# Altium schematic sheet mikrokontroler.SchDoc: Control unit
size A4
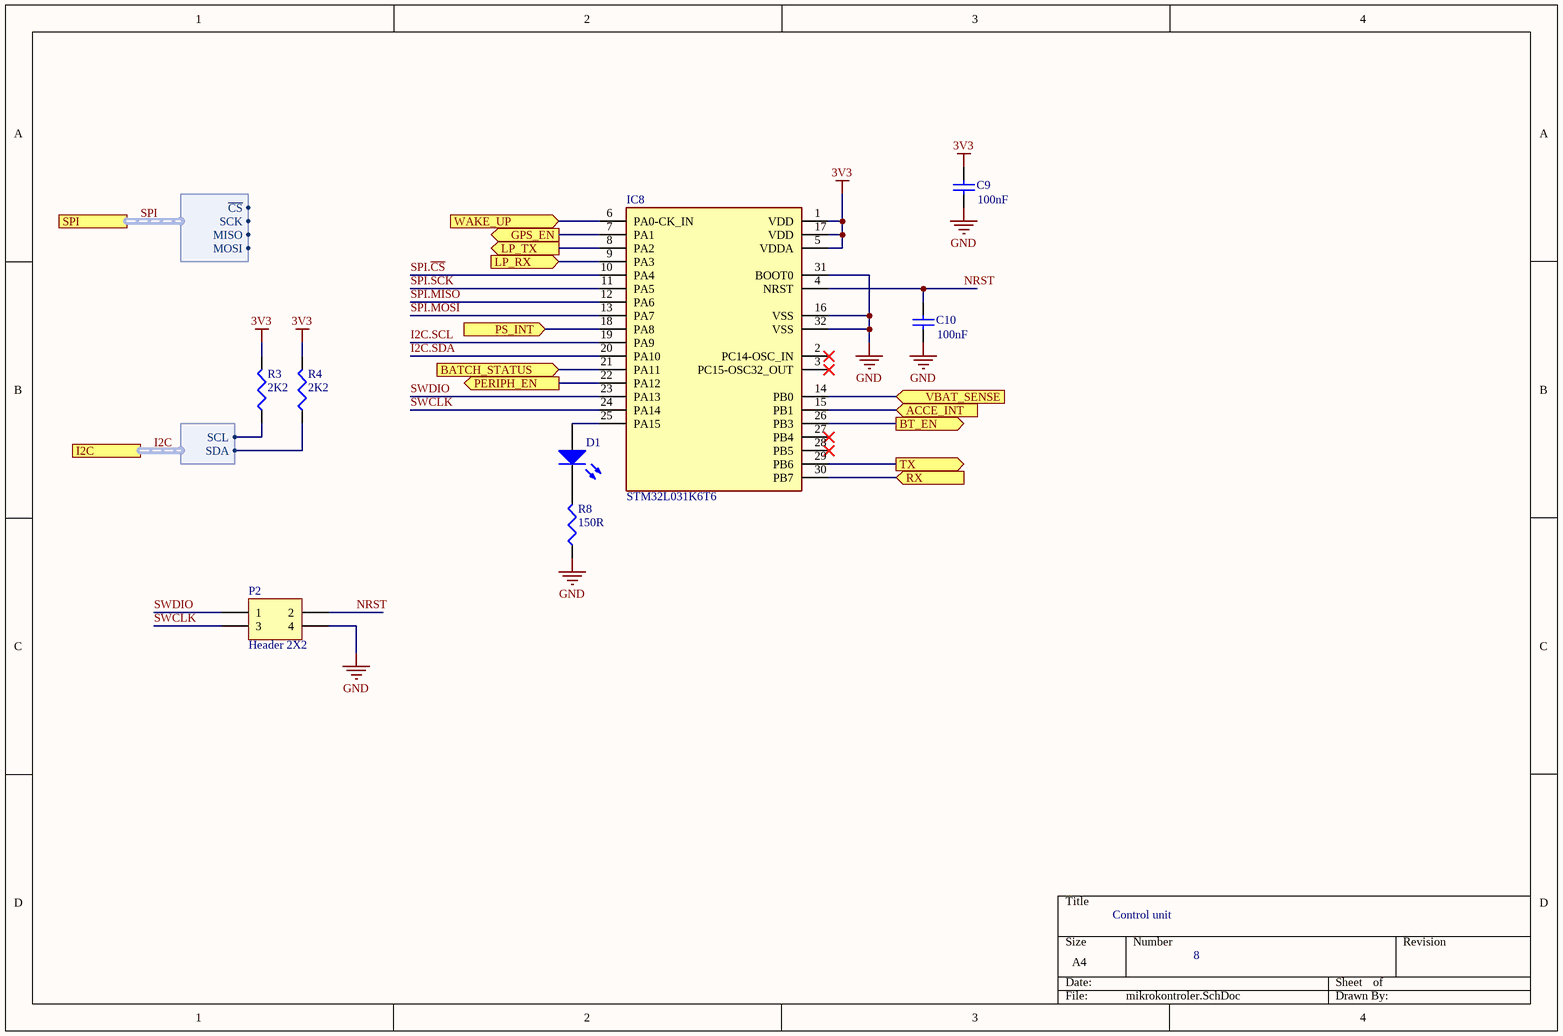
[diagram p0: mikrokontroler.SchDoc]

## Parts
C9  value 100nF  [C0805]  (hidden comment: Cap)
C10  value 100nF  [C0805]  (hidden comment: Cap)
D1  LL-S192PUAC-2A  [LED_0603]  (value not drawn)
IC8  STM32L031K6T6  [QFP80P900X900X160-32N]
P2  Header 2X2  [2x2_header]
R3  value 2K2  [R0603]  (hidden comment: Res3)
R4  value 2K2  [R0603]  (hidden comment: Res3)
R8  value 150R  [R0603]  (hidden comment: Res3)

## Ports
ACCE_INT (in), BATCH_STATUS (in), BT_EN (out), GPS_EN (out), I2C (harness I2C), LP_RX (in), LP_TX (out), PERIPH_EN (out), PS_INT (in), RX (in), SPI (harness SPI), TX (out), VBAT_SENSE (in), WAKE_UP (in)

## Harnesses
SPI: MOSI, MISO, SCK, ~{CS}
I2C: SCL, SDA

## Nets
3V3: C9.2 IC8.1(VDD) IC8.5(VDDA) IC8.17(VDD) R3.2 R4.2
GND: C9.1 C10.1 IC8.16(VSS) IC8.31(BOOT0) IC8.32(VSS) P2.4 R8.1
ACCE_INT: IC8.15(PB1) ; port ACCE_INT
BATCH_STATUS: IC8.21(PA11) ; port BATCH_STATUS
BT_EN: IC8.26(PB3) ; port BT_EN
GPS_EN: IC8.7(PA1) ; port GPS_EN
I2C.SCL: R3.1 ; port I2C.SCL
I2C.SCL: IC8.19(PA9)  [a separate net that carries the same name]
I2C.SDA: R4.1 ; port I2C.SDA
I2C.SDA: IC8.20(PA10)  [a separate net that carries the same name]
LP_RX: IC8.9(PA3) ; port LP_RX
LP_TX: IC8.8(PA2) ; port LP_TX
NRST: C10.2 IC8.4(NRST) P2.2
PERIPH_EN: IC8.22(PA12) ; port PERIPH_EN
PS_INT: IC8.18(PA8) ; port PS_INT
RX: IC8.30(PB7) ; port RX
SPI.~{CS}: IC8.10(PA4)
SPI.MISO: IC8.12(PA6)
SPI.MOSI: IC8.13(PA7)
SPI.SCK: IC8.11(PA5)
SWCLK: IC8.24(PA14) P2.3
SWDIO: IC8.23(PA13) P2.1
TX: IC8.29(PB6) ; port TX
VBAT_SENSE: IC8.14(PB0) ; port VBAT_SENSE
WAKE_UP: IC8.6(PA0-CK_IN) ; port WAKE_UP
NetD1_1: D1.1(A) IC8.25(PA15)
NetD1_2: D1.2(K) R8.2

Not connected (* = marked no-connect by the designer): IC8 2(PC14-OSC_IN)* 3(PC15-OSC32_OUT)* 27(PB4)* 28(PB5)*

## Buses and harness runs
harness I2C = port I2C
harness SPI = port SPI

## Notes on the sheet
- 8

## Library data of the parts
C9 C10 = Cap: Capacitor; Published: 8-Jun-2000; LatestRevisionDate: 17-Jul-2002; LatestRevisionNote: Re-released for DXP Platform.; PackageReference: RAD-0.3; Publisher: Altium Limited; PackageDescription: Radial Cap, Thru-Hole; 2 Leads; 0.3 in Pin Spacing
D1 = LED3: Typical BLUE SiC LED; Published: 8-Jun-2000; LatestRevisionDate: 17-Dec-2003; LatestRevisionNote: PCB Footprint replaced.; DatasheetVersion: 16-Apr-2002; PackageVersion: 16-Apr-2002; PackageReference: 3.5X2.8X1.9; Publisher: Altium Limited; PackageDescription: SM LED; 2 C-Bend Leads; Body 3.5 x 2.8 x 1.9 mm, inc leads (LxWxH typ)
IC8 = STM32L031K6T6: Integrated Circuit; Manufacturer_Name: STMicroelectronics; Datasheet Link: https://www.st.com/resource/en/datasheet/stm32l031k6.pdf; Height: 1.6mm; Manufacturer_Part_Number: STM32L031K6T6; Arrow Part Number: STM32L031K6T6; Arrow Price/Stock: https://www.arrow.com/en/products/stm32l031k6t6/stmicroelectronics; Mouser Part Number: 511-STM32L031K6T6; Mouser Price/Stock: https://www.mouser.co.uk/ProductDetail/STMicroelectronics/STM32L031K6T6?qs=mwoc%252BQmZlGIAMyWzQ3GanA%3D%3D
P2 = Header 2X2: Header, 2-Pin, Dual row; LatestRevisionDate: 17-Jul-2002; LatestRevisionNote: Re-released for DXP Platform.; Publisher: Altium Limited
R3 R4 R8 = Res3: Resistor; Published: 8-Jun-2000; LatestRevisionDate: 29-May-2009; LatestRevisionNote: IPC-7351 Footprint Added.; PackageReference: J1-0603; Publisher: Altium Limited; PackageDescription: Chip Resistor